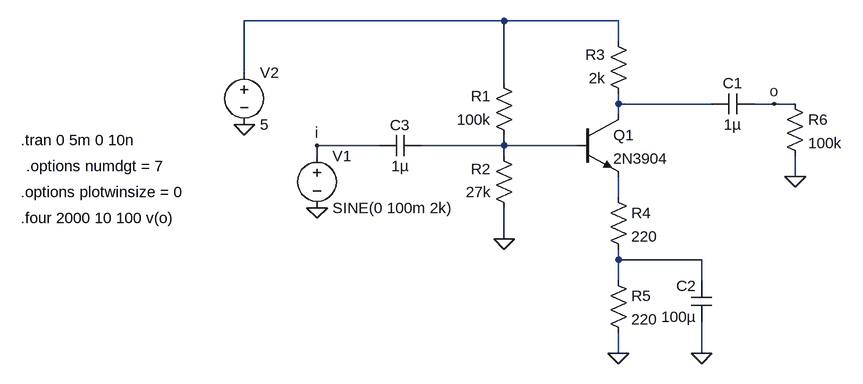
[diagram p0: schematic fig1-2.asc]
fig1-2.asc, the LTspice schematic file:
Version 4
SHEET 1 1100 680
WIRE 320 -64 -80 -64
WIRE 496 -64 320 -64
WIRE 496 -32 496 -64
WIRE -80 16 -80 -64
WIRE 320 32 320 -64
WIRE 496 64 496 48
WIRE 640 64 496 64
WIRE 736 64 704 64
WIRE 768 64 736 64
WIRE 496 80 496 64
WIRE 128 128 32 128
WIRE 320 128 320 112
WIRE 320 128 192 128
WIRE 432 128 320 128
WIRE 32 144 32 128
WIRE 320 144 320 128
WIRE 768 176 768 144
WIRE 496 208 496 176
WIRE 320 272 320 224
WIRE 496 304 496 288
WIRE 624 304 496 304
WIRE 496 336 496 304
WIRE 624 336 624 304
WIRE 496 448 496 416
WIRE 624 448 624 400
FLAG 32 224 0
FLAG -80 96 0
FLAG 768 176 0
FLAG 624 448 0
FLAG 496 448 0
FLAG 320 272 0
FLAG 32 128 i
FLAG 736 64 o
SYMBOL voltage 32 128 R0
WINDOW 123 0 0 Left 0
WINDOW 39 0 0 Left 0
SYMATTR InstName V1
SYMATTR Value SINE(0 100m 2k)
SYMBOL voltage -80 0 R0
WINDOW 123 0 0 Left 0
WINDOW 39 0 0 Left 0
SYMATTR InstName V2
SYMATTR Value 5
SYMBOL res 336 128 R180
WINDOW 0 36 76 Left 2
WINDOW 3 36 40 Left 2
SYMATTR InstName R1
SYMATTR Value 100k
SYMBOL res 336 240 R180
WINDOW 0 36 76 Left 2
WINDOW 3 36 40 Left 2
SYMATTR InstName R2
SYMATTR Value 27k
SYMBOL res 512 64 R180
WINDOW 0 36 76 Left 2
WINDOW 3 36 40 Left 2
SYMATTR InstName R3
SYMATTR Value 2k
SYMBOL npn 432 80 R0
SYMATTR InstName Q1
SYMATTR Value 2N3904
SYMBOL res 480 192 R0
SYMATTR InstName R4
SYMATTR Value 220
SYMBOL res 480 320 R0
SYMATTR InstName R5
SYMATTR Value 220
SYMBOL cap 704 48 R90
WINDOW 0 0 32 VBottom 2
WINDOW 3 32 32 VTop 2
SYMATTR InstName C1
SYMATTR Value 1µ
SYMBOL cap 640 400 R180
WINDOW 0 24 56 Left 2
WINDOW 3 24 8 Left 2
SYMATTR InstName C2
SYMATTR Value 100µ
SYMBOL res 752 48 R0
SYMATTR InstName R6
SYMATTR Value 100k
SYMBOL cap 192 112 R90
WINDOW 0 0 32 VBottom 2
WINDOW 3 32 32 VTop 2
SYMATTR InstName C3
SYMATTR Value 1µ
TEXT -424 120 Left 2 !.tran 0 5m 0 10n
TEXT -416 160 Left 2 !.options numdgt = 7
TEXT -424 200 Left 2 !.options plotwinsize = 0
TEXT -424 240 Left 2 !.four 2000 10 100 v(o)

The netlist it stands for:
* fig1-2.asc
V1 i 0 SINE(0 100m 2k)
V2 N001 0 5
R1 N003 N001 100k
R2 0 N003 27k
R3 N002 N001 2k
Q1 N002 N003 N004 0 2N3904
R4 N004 N005 220
R5 N005 0 220
C1 o N002 1µ
C2 0 N005 100µ
R6 o 0 100k
C3 N003 i 1µ
.model NPN NPN
.model PNP PNP
.lib standard.bjt
.tran 0 5m 0 10n
.options numdgt = 7
.options plotwinsize = 0
.four 2000 10 100 v(o)
.backanno
.end